# EasyEDA schematic My-VONE-6502 Control-Board Key & Display_2021-02-14_09-01-07.json
TITLE: Control-Board Key And Display; REV: 1.0; Date: 2020-09-05; Sheet: 1/1; Drawn By: termineric; Company: Your Company
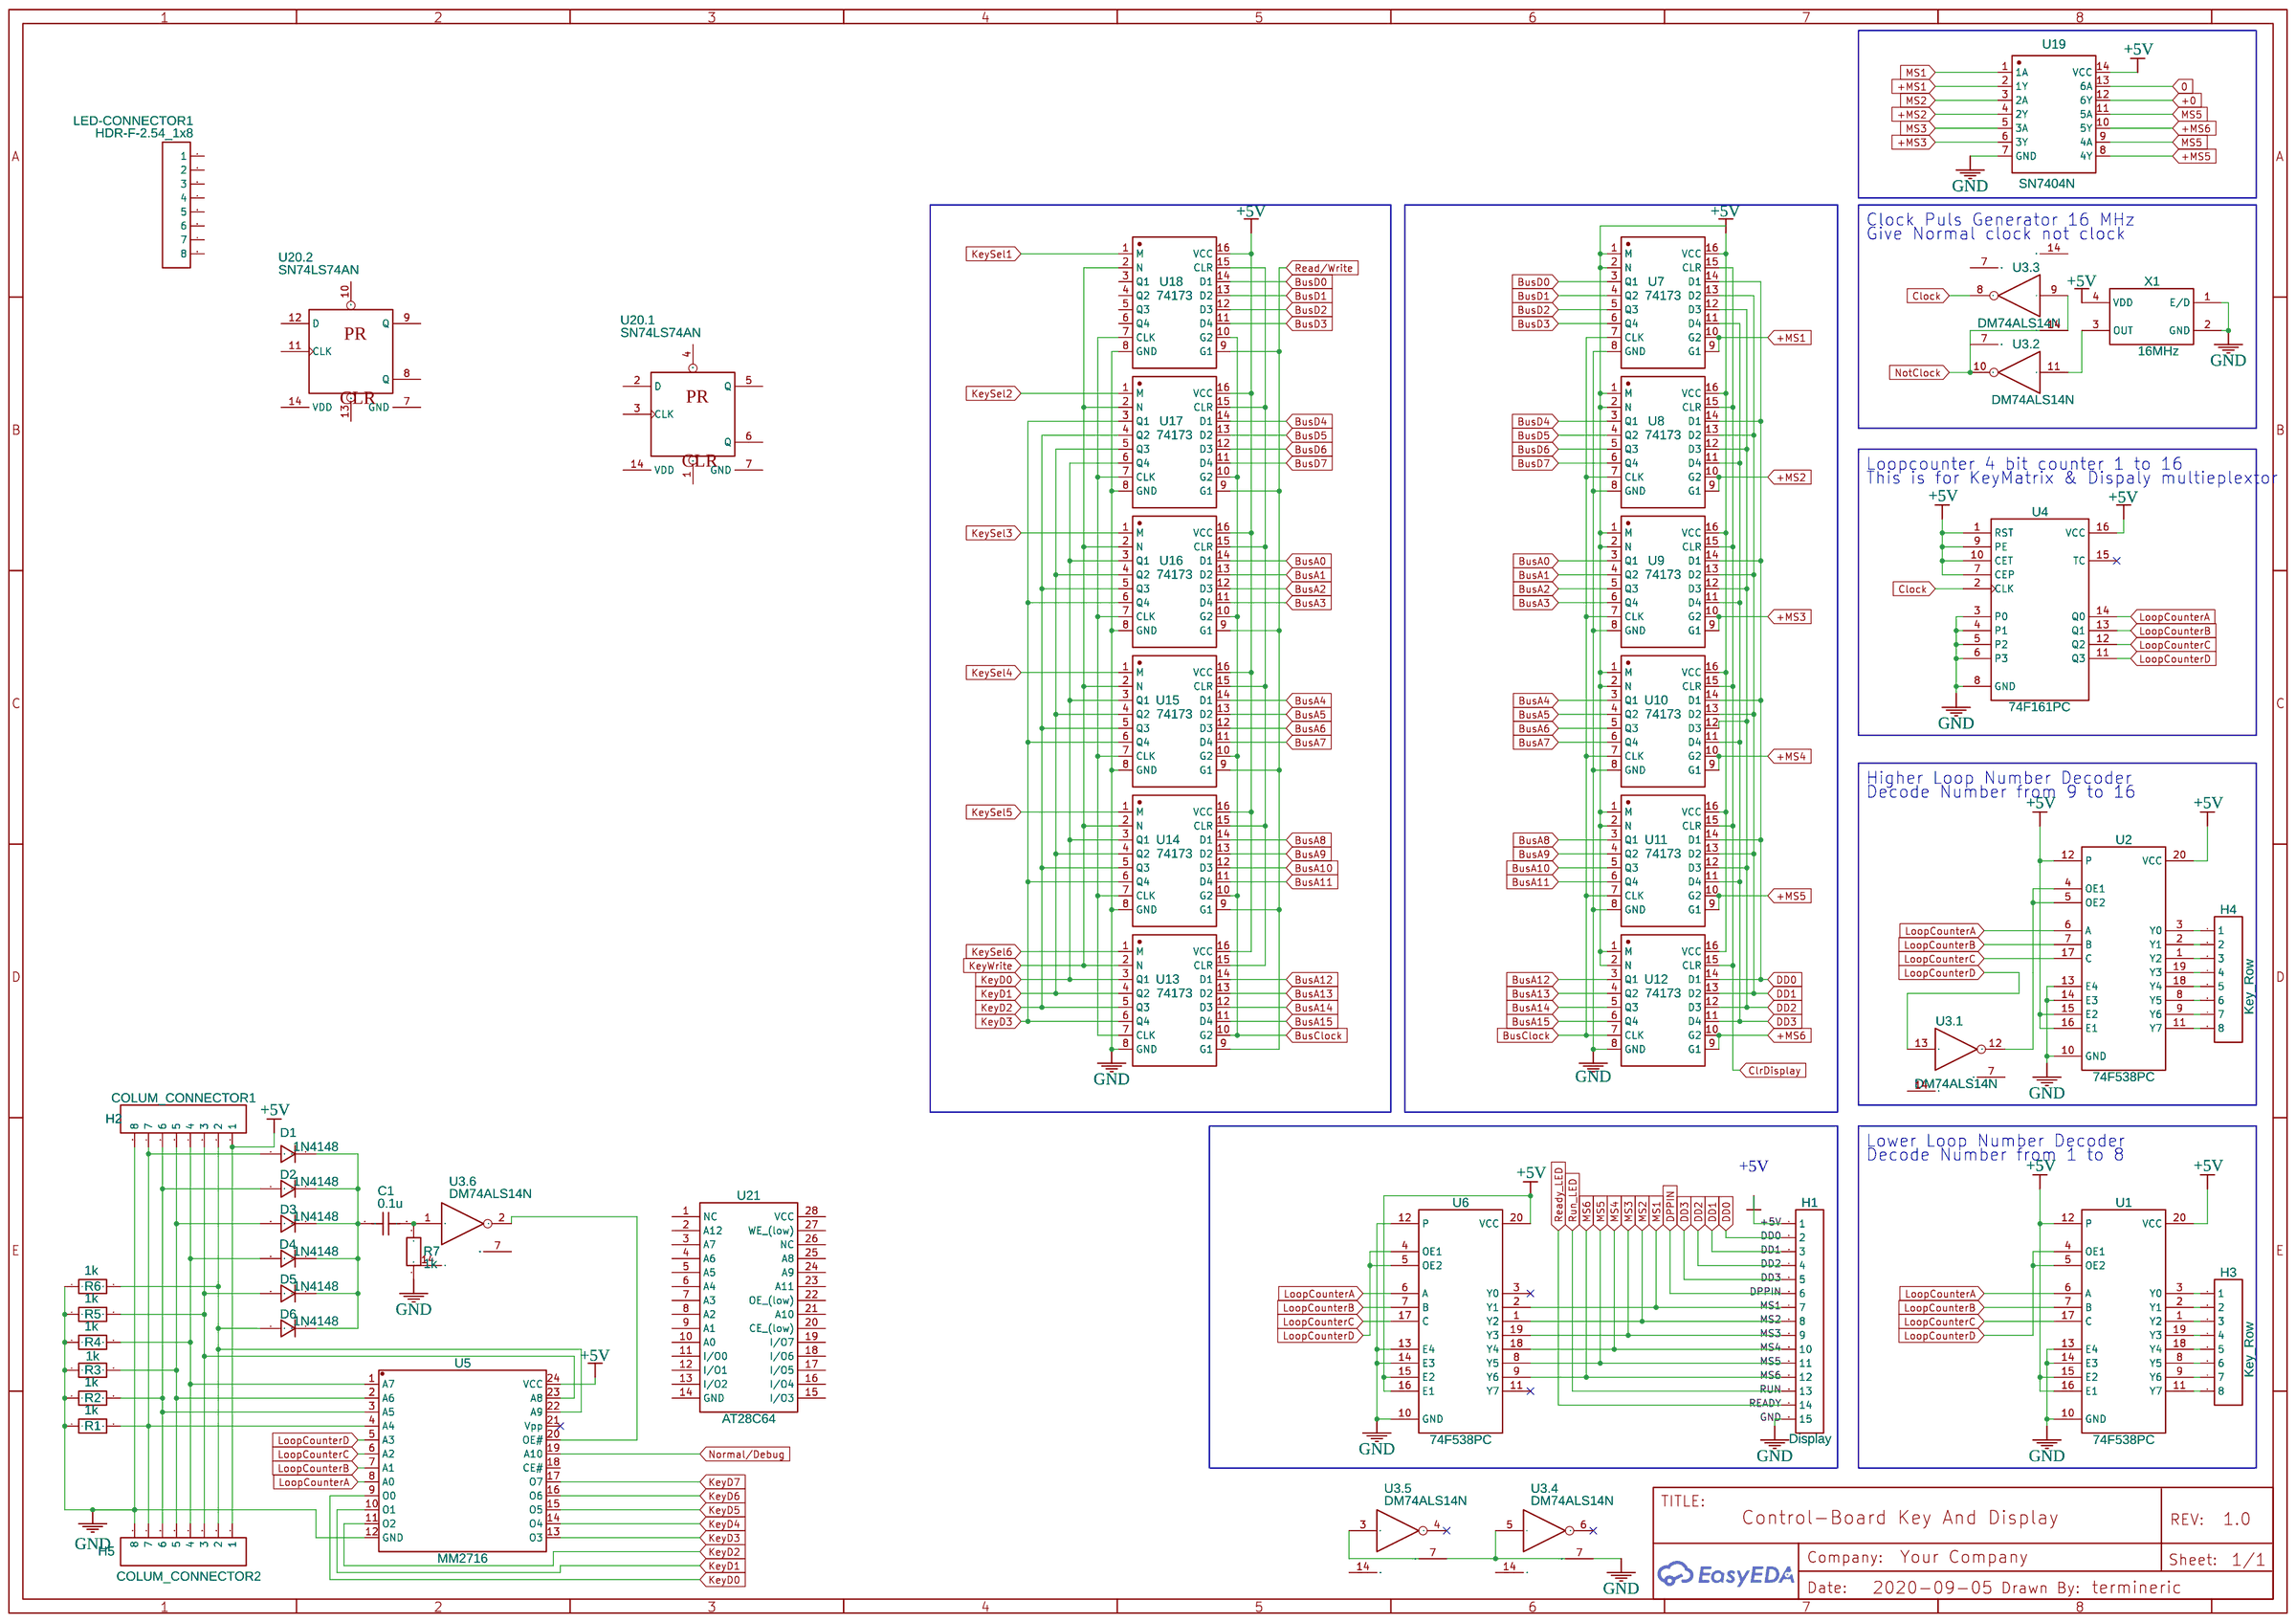
[diagram p0: schematic sheet]

## Parts
C1  0.1u  [C0603]
D1  1N4148  [DO-35_BD2.0-L4.0-P8.00-D0.5-FD]
D2  1N4148  [DO-35_BD2.0-L4.0-P8.00-D0.5-FD]
D3  1N4148  [DO-35_BD2.0-L4.0-P8.00-D0.5-FD]
D4  1N4148  [DO-35_BD2.0-L4.0-P8.00-D0.5-FD]
D5  1N4148  [DO-35_BD2.0-L4.0-P8.00-D0.5-FD]
D6  1N4148  [DO-35_BD2.0-L4.0-P8.00-D0.5-FD]
H1  Display  [HDR-F-2.54_1X15]
H2  COLUM_CONNECTOR1  [HDR-F-2.54_1X8]
H3  Key_Row  [HDR-F-2.54_1X8]
H4  Key_Row  [HDR-F-2.54_1X8]
H5  COLUM_CONNECTOR2  [HDR-F-2.54_1X8]
LED-CONNECTOR1  HDR-F-2.54_1x8  [HDR-F-2.54_1X8]
R1  1k  [R0603]
R2  1k  [R0603]
R3  1k  [R0603]
R4  1k  [R0603]
R5  1k  [R0603]
R6  1k  [R0603]
R7  1k  [R0603]
U1  74F538PC  [DIP20]
U2  74F538PC  [DIP20]
U3  DM74ALS14N  [DIP14]  (sections 1,2,3,4,5,6)
U4  74F161PC  [DIP16]
U5  MM2716  [DIP-24_L32.0-W13.8-P2.54-LS15.6-BL]
U6  74F538PC  [DIP20]
U7  74173  [DIP16]
U8  74173  [DIP16]
U9  74173  [DIP16]
U10  74173  [DIP16]
U11  74173  [DIP16]
U12  74173  [DIP16]
U13  74173  [DIP16]
U14  74173  [DIP16]
U15  74173  [DIP16]
U16  74173  [DIP16]
U17  74173  [DIP16]
U18  74173  [DIP16]
U19  SN7404N  [DIP14]
U20  SN74LS74AN  [DIP14]  (sections 1,2)
U21  AT28C64  [AT28C64]
X1  16MHz  [OSC-TH_4P-L20.4-W12.8-P15.24-BL]

## Library data of the parts
C1 = C_0603_US: Contributor: LCEDA_Lib
D1-D6 = 1N4148: Supplier: LCSC; Manufacturer: SEMTECH; Supplier Part: C14516; Contributor: LCEDA_Lib
H1 = HDR-F-2.54_1x15: Supplier Part: C124408; Supplier: LCSC; Contributor: LCEDA_Lib
H2-H5 LED-CONNECTOR1 = HDR-F-2.54_1x8: Supplier Part: C225505; Supplier: LCSC; Contributor: LCEDA_Lib
R1-R7 = R_0603_EU: Contributor: LCEDA_Lib
U1 U2 U6 = 74F538PC: 1-of-8 Decoder with 3-State Output
U3 = DM74ALS14N: Hex Schmitt-Trigger Inverter, 14-Pin PDIP; subpart_no: 1
U4 = 74F161PC: Synchronous Presettable Binary Counter
U5 = MM2716: Contributor: termineric
U7-U18 = 74173
U19 = SN7404N
U20 = SN74LS74AN: Dual D-Type Positive Edge-Triggered Flip-Flop; subpart_no: 1
U21 = AT28C64: Contributor: Miryhan
X1 = O1512D2MFDA4SC: Supplier: LCSC; Manufacturer: YXC; Supplier Part: C53929

## Nets
+5V: H1.1 H2.1 H5.1 U1.12(P) U1.15(E2) U1.16(E1) U1.20(VCC) U2.12(P) U2.15(E2) U2.16(E1) U2.20(VCC) U4.1(RST) U4.7(CEP) U4.9(PE) U4.10(CET) U4.16(VCC) U5.24(VCC) U6.15(E2) U6.16(E1) U6.20(VCC) U7.16(VCC) U8.16(VCC) U9.16(VCC) U10.16(VCC) U11.16(VCC) U12.16(VCC) U13.16(VCC) U14.16(VCC) U15.16(VCC) U16.16(VCC) U17.16(VCC) U18.16(VCC) U19.14(VCC) X1.4(VDD)
GND: H1.15 H2.8 H5.8 R1.1 R2.1 R3.1 R4.1 R5.1 R6.1 R7.1 U1.10(GND) U1.13(E4) U1.14(E3) U2.10(GND) U2.13(E4) U2.14(E3) U3.3(A) U3.5(A) U4.3(P0) U4.4(P1) U4.5(P2) U4.6(P3) U4.8(GND) U5.12(GND) U6.10(GND) U6.12(P) U6.13(E4) U6.14(E3) U7.8(GND) U8.8(GND) U9.8(GND) U10.8(GND) U11.8(GND) U12.8(GND) U13.8(GND) U14.8(GND) U15.8(GND) U16.8(GND) U17.8(GND) U18.8(GND) U19.7(GND) X1.1(E/D) X1.2(GND)
0: U19.13(6A)
+0: U19.12(6Y)
+MS1: U7.9(G1) U7.10(G2) U19.2(1Y)
+MS2: U8.9(G1) U8.10(G2) U19.4(2Y)
+MS3: U9.9(G1) U9.10(G2) U19.6(3Y)
+MS4: U10.9(G1) U10.10(G2)
+MS5: U11.9(G1) U11.10(G2) U19.8(4Y)
+MS6: U12.9(G1) U12.10(G2) U19.10(5Y)
BusA0: U9.3(Q1) U16.14(D1)
BusA1: U9.4(Q2) U16.13(D2)
BusA2: U9.5(Q3) U16.12(D3)
BusA3: U9.6(Q4) U16.11(D4)
BusA4: U10.3(Q1) U15.14(D1)
BusA5: U10.4(Q2) U15.13(D2)
BusA6: U10.5(Q3) U15.12(D3)
BusA7: U10.6(Q4) U15.11(D4)
BusA8: U11.3(Q1) U14.14(D1)
BusA9: U11.4(Q2) U14.13(D2)
BusA10: U11.5(Q3) U14.12(D3)
BusA11: U11.6(Q4) U14.11(D4)
BusA12: U12.3(Q1) U13.14(D1)
BusA13: U12.4(Q2) U13.13(D2)
BusA14: U12.5(Q3) U13.12(D3)
BusA15: U12.6(Q4) U13.11(D4)
BusClock: U7.7(CLK) U8.7(CLK) U9.7(CLK) U10.7(CLK) U11.7(CLK) U12.7(CLK) U13.10(G2) U14.10(G2) U15.10(G2) U16.10(G2) U17.10(G2) U18.10(G2)
BusD0: U7.3(Q1) U18.14(D1)
BusD1: U7.4(Q2) U18.13(D2)
BusD2: U7.5(Q3) U18.12(D3)
BusD3: U7.6(Q4) U18.11(D4)
BusD4: U8.3(Q1) U17.14(D1)
BusD5: U8.4(Q2) U17.13(D2)
BusD6: U8.5(Q3) U17.12(D3)
BusD7: U8.6(Q4) U17.11(D4)
Clock: U3.8(Y) U4.2(CLK)
ClrDisplay: U7.15(CLR) U8.15(CLR) U9.15(CLR) U10.15(CLR) U11.15(CLR) U12.15(CLR)
DD0: H1.2 U7.14(D1) U8.14(D1) U9.14(D1) U10.14(D1) U11.14(D1) U12.14(D1)
DD1: H1.3 U7.13(D2) U8.13(D2) U9.13(D2) U10.13(D2) U11.13(D2) U12.13(D2)
DD2: H1.4 U7.12(D3) U8.12(D3) U9.12(D3) U10.12(D3) U11.12(D3) U12.12(D3)
DD3: H1.5 U7.11(D4) U8.11(D4) U9.11(D4) U10.11(D4) U11.11(D4) U12.11(D4)
DPPIN: H1.6
KeyD0: U5.9(O0) U13.3(Q1) U14.3(Q1) U15.3(Q1) U16.3(Q1) U17.6(Q4)
KeyD1: U5.10(O1) U13.4(Q2) U14.4(Q2) U15.4(Q2) U16.4(Q2) U17.5(Q3)
KeyD2: U5.11(O2) U13.5(Q3) U14.5(Q3) U15.5(Q3) U16.5(Q3) U17.4(Q2)
KeyD3: U5.13(O3) U13.6(Q4) U14.6(Q4) U15.6(Q4) U16.6(Q4) U17.3(Q1)
KeyD4: U5.14(O4)
KeyD5: U5.15(O5)
KeyD6: U5.16(O6)
KeyD7: U5.17(O7)
KeySel1: U18.1(M)
KeySel2: U17.1(M)
KeySel3: U16.1(M)
KeySel4: U15.1(M)
KeySel5: U14.1(M)
KeySel6: U13.1(M)
KeyWrite: U13.2(N) U14.2(N) U15.2(N) U16.2(N) U17.2(N) U18.2(N)
LoopCounterA: U1.6(A) U2.6(A) U4.14(Q0) U5.8(A0) U6.6(A)
LoopCounterB: U1.7(B) U2.7(B) U4.13(Q1) U5.7(A1) U6.7(B)
LoopCounterC: U1.17(C) U2.17(C) U4.12(Q2) U5.6(A2) U6.17(C)
LoopCounterD: U1.4(OE1) U1.5(OE2) U3.13(A) U4.11(Q3) U5.5(A3) U6.4(OE1) U6.5(OE2)
MS1: H1.7 U6.2(Y1) U19.1(1A)
MS2: H1.8 U6.1(Y2) U19.3(2A)
MS3: H1.9 U6.19(Y3) U19.5(3A)
MS4: H1.10 U6.18(Y4)
MS5: H1.11 U6.8(Y5) U19.9(4A) U19.11(5A)
MS6: H1.12 U6.9(Y6)
Normal/Debug: U5.19(A10)
NotClock: U3.9(A) U3.10(Y) U3.14(VCC)
Read/Write: U13.9(G1) U14.9(G1) U15.9(G1) U16.9(G1) U17.9(G1) U18.9(G1)
READY: H1.14
RUN: H1.13
Net-(C1-1): C1.1 D1.2 D2.2 D3.2 D4.2 D5.2 D6.2
Net-(C1-2): C1.2 R7.2 U3.1(A)
Net-(D1-1): D1.1 H2.7 H5.7 R1.2 U5.4(A4)
Net-(D2-1): D2.1 H2.6 H5.6 R2.2 U5.3(A5)
Net-(D3-1): D3.1 H2.5 H5.5 R3.2 U5.2(A6)
Net-(D4-1): D4.1 H2.4 H5.4 R4.2 U5.1(A7)
Net-(D5-1): D5.1 H2.3 H5.3 R5.2 U5.23(A8)
Net-(D6-1): D6.1 H2.2 H5.2 R6.2 U5.22(A9)
Net-(H3-1): H3.1 U1.3(Y0)
Net-(H3-2): H3.2 U1.2(Y1)
Net-(H3-3): H3.3 U1.1(Y2)
Net-(H3-4): H3.4 U1.19(Y3)
Net-(H3-5): H3.5 U1.18(Y4)
Net-(H3-6): H3.6 U1.8(Y5)
Net-(H3-7): H3.7 U1.9(Y6)
Net-(H3-8): H3.8 U1.11(Y7)
Net-(H4-1): H4.1 U2.3(Y0)
Net-(H4-2): H4.2 U2.2(Y1)
Net-(H4-3): H4.3 U2.1(Y2)
Net-(H4-4): H4.4 U2.19(Y3)
Net-(H4-5): H4.5 U2.18(Y4)
Net-(H4-6): H4.6 U2.8(Y5)
Net-(H4-7): H4.7 U2.9(Y6)
Net-(H4-8): H4.8 U2.11(Y7)
Net-(U2-4): U2.4(OE1) U2.5(OE2) U3.12(Y)
Net-(U3.2-11): U3.11(A) X1.3(OUT)
Net-(U3.6-2): U3.2(Y) U5.20(OE#)
Net-(U7-1): U7.1(M) U7.2(N) U8.1(M) U8.2(N) U9.1(M) U9.2(N) U10.1(M) U10.2(N) U11.1(M) U11.2(N) U12.1(M) U12.2(N)
Net-(U13-7): U13.7(CLK) U14.7(CLK) U15.7(CLK) U16.7(CLK) U17.7(CLK) U18.7(CLK)
Net-(U13-15): U13.15(CLR) U14.15(CLR) U15.15(CLR) U16.15(CLR) U17.15(CLR) U18.15(CLR)

Not connected (* = marked no-connect by the designer): LED-CONNECTOR1 1 2 3 4 5 6 7 8; U3 4(Y)* 6(Y)* 7(GND); U4 15(TC)*; U5 18(CE#) 21(Vpp)*; U6 3(Y0)* 11(Y7)*; U18 3(Q1) 4(Q2) 5(Q3) 6(Q4); U20 1(CLR) 2(D) 3(CLK) 4(PR) 5(Q) 6(Q) 7(GND) 8(Q) 9(Q) 10(PR) 11(CLK) 12(D) 13(CLR) 14(VDD); U21 1(NC) 2(A12) 3(A7) 4(A6) 5(A5) 6(A4) 7(A3) 8(A2) 9(A1) 10(A0) 11(I/O0) 12(I/O1) 13(I/O2) 14(GND) 15(I/O3) 16(I/O4) 17(I/O5) 18(I/O6) 19(I/O7) 20(CE (low)) 21(A10) 22(OE (low)) 23(A11) 24(A9) 25(A8) 26(NC) 27(WE (low)) 28(VCC)

## Notes on the sheet
- Clock Puls Generator 16 MHz
- Give Normal clock not clock
- Loopcounter 4 bit counter 1 to 16
- This is for KeyMatrix & Dispaly multieplextor
- Higher Loop Number Decoder
- Decode Number from 9 to 16
- Lower Loop Number Decoder
- Decode Number from 1 to 8
